# EAGLE schematic Ex Protection (EAGLE 7.5.0)
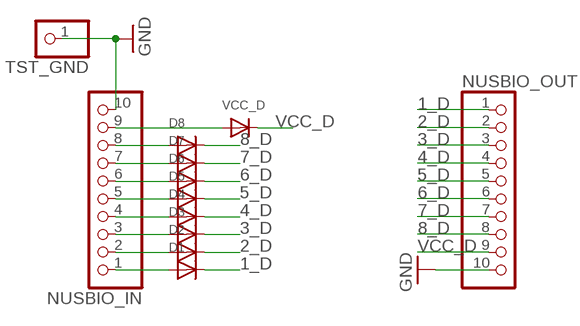
[diagram p0: schematic, sheet 1]

## Parts
D1  DIODESOD-123  [SOD-123]
D2  DIODESOD-123  [SOD-123]
D3  DIODESOD-123  [SOD-123]
D4  DIODESOD-123  [SOD-123]
D5  DIODESOD-123  [SOD-123]
D6  DIODESOD-123  [SOD-123]
D7  DIODESOD-123  [SOD-123]
D8  DIODESOD-123  [SOD-123]
NUSBIO_IN  PINHD-1X10  [1X10-BIG]
NUSBIO_OUT  PINHD-1X10  [1X10-BIG]
TST_GND  PINHD-1X1  [1X01]
VCC_D  DIODESOD-123  [SOD-123]

## Nets
1_D: D1.C NUSBIO_OUT.1
2_D: D2.C NUSBIO_OUT.2
3_D: D3.C NUSBIO_OUT.3
4_D: D4.C NUSBIO_OUT.4
5_D: D5.C NUSBIO_OUT.5
6_D: D6.C NUSBIO_OUT.6
7_D: D7.C NUSBIO_OUT.7
8_D: D8.C NUSBIO_OUT.8
GND: NUSBIO_IN.10 NUSBIO_OUT.10 TST_GND.1
N$1: D1.A NUSBIO_IN.1
N$2: D2.A NUSBIO_IN.2
N$3: D3.A NUSBIO_IN.3
N$4: D4.A NUSBIO_IN.4
N$5: D5.A NUSBIO_IN.5
N$6: D6.A NUSBIO_IN.6
N$7: D7.A NUSBIO_IN.7
N$8: D8.A NUSBIO_IN.8
N$9: NUSBIO_IN.9 VCC_D.A
VCC_D: NUSBIO_OUT.9 VCC_D.C

## Library data of the parts
D1-D8 VCC_D = adafruit:DIODE: Diode SMADIODE - SMA Surface Mount Package 20V 1A Schottky Diode Digikey: 641-1014-6-ND DO-1N4148 - Through Hole Small Current Diode SOD-123 20V 1 A (.5mV Vf) Schottky Diode - Digikey: MBRX120TPMSCT-ND SOD-323 10V 570mA (.38mV Vf, 3ns) Schottky Diode - Digikey: ZLLS410CT-ND SOD-523 30V 30mA Schottky Diode (RB751S-40TE61) - Digikey: RB751S-40TE61CT-ND SOT23-R/W - SOT23 Package (R = Solder Paste/Reflow Ovens, W = Hand-Soldering) BAT54Film 40V 300mA - Digikey: 497-7162-1-ND
NUSBIO_IN NUSBIO_OUT = adafruit:PINHD-1X10: Pin header 1x10 0.1" spacing With round pins
TST_GND = adafruit:PINHD-1X1: Pin header 1x1 for 0.1" spacing With round pins